# Altium schematic sheet ESP32_BDB-1.SchDoc
size Tabloid; SheetNumber: 1; SheetTotal: 2
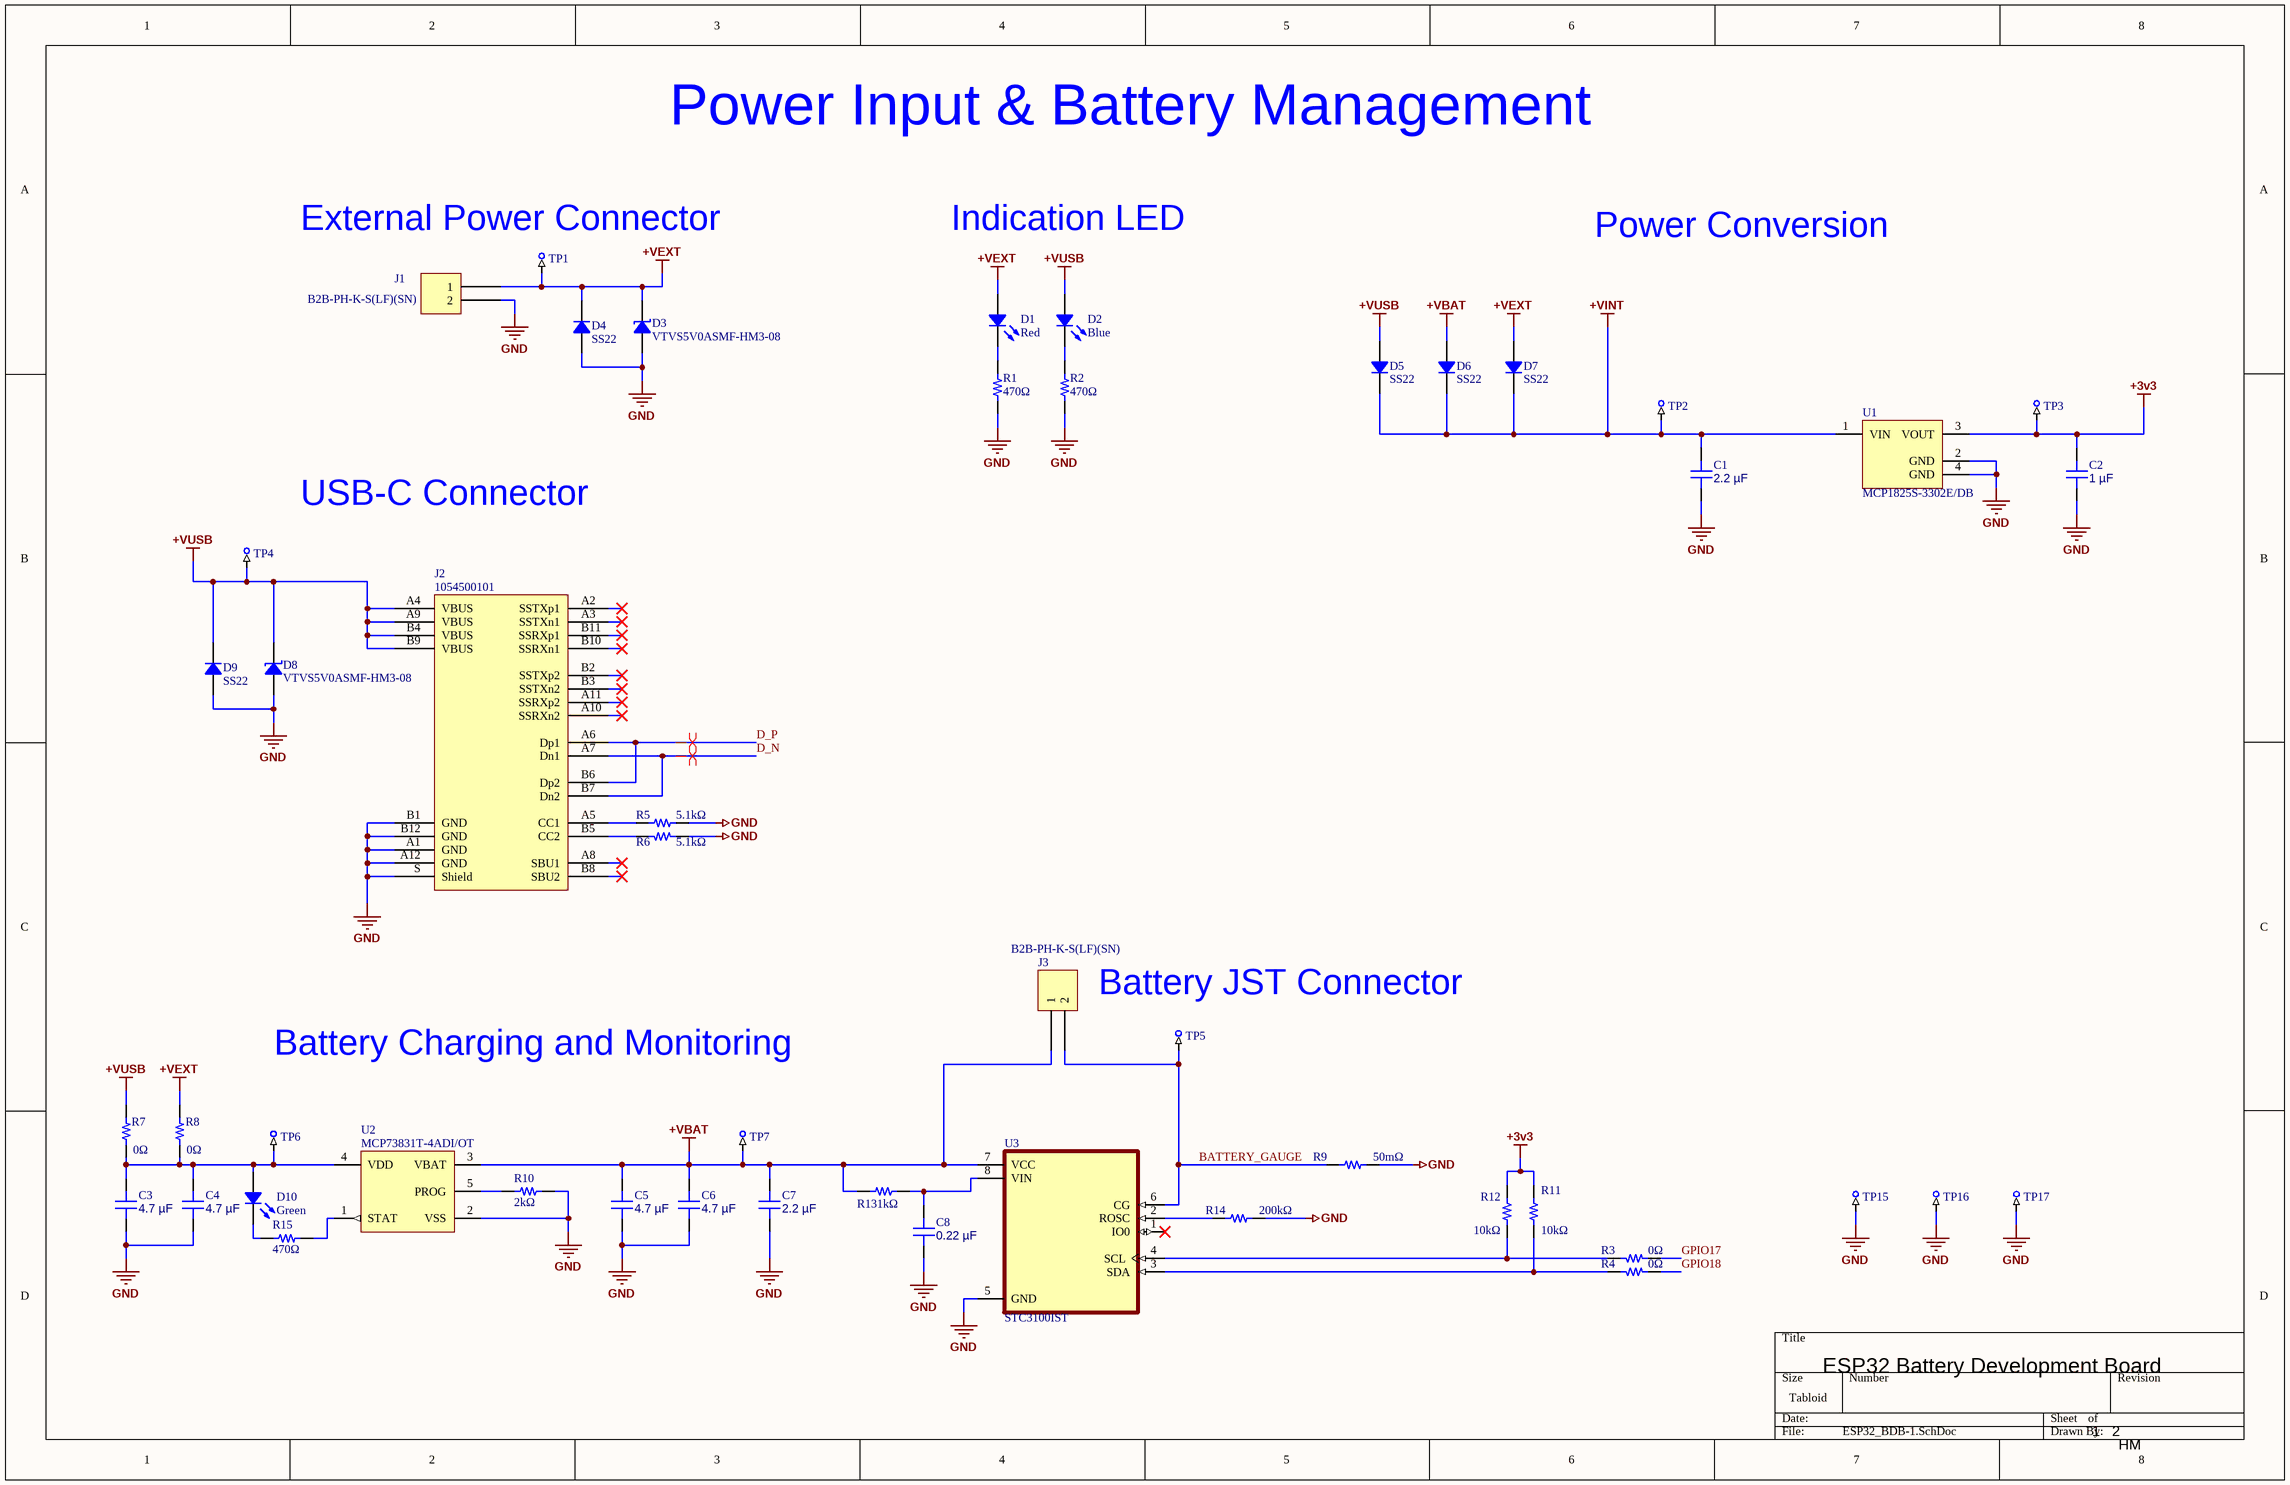
[diagram p0: ESP32_BDB-1.SchDoc]

## Parts
C1  2.2 µF  [CAP 0805_2012]
C2  1 µF  [CAP 0805_2012]
C3  4.7 µF  [CAP 0805_2012]
C4  4.7 µF  [CAP 0805_2012]
C5  4.7 µF  [CAP 0805_2012]
C6  4.7 µF  [CAP 0805_2012]
C7  2.2 µF  [CAP 0603_1608]
C8  0.22 µF  [CAP 0603_1608]
D1  Red  [LED 0805_2012 RED]
D2  Blue  [LED 0805_2012 BLUE]
D3  VTVS5V0ASMF-HM3-08  [SMF DO-219AB]
D4  SS22  [DO214AA SMB]
D5  SS22  [DO214AA SMB]
D6  SS22  [DO214AA SMB]
D7  SS22  [DO214AA SMB]
D8  VTVS5V0ASMF-HM3-08  [SMF DO-219AB]
D9  SS22  [DO214AA SMB]
D10  Green  [LED 0805_2012 GREEN]
J1  B2B-PH-K-S(LF)(SN)  [JST B2B-PH-K]
J2  1054500101  [Molex 1054500101]
J3  B2B-PH-K-S(LF)(SN)  [JST B2B-PH-K]
R1  470Ω  [RES 0603_1608]
R2  470Ω  [RES 0603_1608]
R3  0Ω  [RES 0805_2012]
R4  0Ω  [RES 0805_2012]
R5  5.1kΩ  [RES 0603_1608]
R6  5.1kΩ  [RES 0603_1608]
R7  0Ω  [RES 0805_2012]
R8  0Ω  [RES 0805_2012]
R9  50mΩ  [RES 0805_2012]
R10  2kΩ  [RES 0603_1608]
R11  10kΩ  [RES 0603_1608]
R12  10kΩ  [RES 0603_1608]
R13  1kΩ  [RES 0603_1608]
R14  200kΩ  [RES 0603_1608]
R15  470Ω  [RES 0603_1608]
TP1  5016  [KEYSTONE-5016_V]  (value not drawn)
TP2  5016  [KEYSTONE-5016_V]  (value not drawn)
TP3  5016  [KEYSTONE-5016_V]  (value not drawn)
TP4  5016  [KEYSTONE-5016_V]  (value not drawn)
TP5  5016  [KEYSTONE-5016_V]  (value not drawn)
TP6  5016  [KEYSTONE-5016_V]  (value not drawn)
TP7  5016  [KEYSTONE-5016_V]  (value not drawn)
TP15  5016  [KEYSTONE-5016_V]  (value not drawn)
TP16  5016  [KEYSTONE-5016_V]  (value not drawn)
TP17  5016  [KEYSTONE-5016_V]  (value not drawn)
U1  MCP1825S-3302E/DB  [SOT-223-DB3_N]
U2  MCP73831T-4ADI/OT  [SOT-23-OT5_N]
U3  STC3100IST  [SOIC65P490X110-8N]

## Nets
+3v3: C2.2 R11.2 R12.2 TP3.1 U1.3(VOUT)
+VBAT: C5.2 C6.2 C7.2 D6.1 J3.1 R13.1 TP7.1 U2.3(VBAT) U3.7(VCC)
+VEXT: D1.1 D3.2 D4.2 D7.1 J1.1 R8.2 TP1.1
+VINT: C1.2 D5.2 D6.2 D7.2 TP2.1 U1.1(VIN)
+VUSB: D2.1 D5.1 D8.2 D9.2 J2.A4(VBUS) J2.A9(VBUS) J2.B4(VBUS) J2.B9(VBUS) R7.2 TP4.1
GND: C1.1 C2.1 C3.1 C4.1 C5.1 C6.1 C7.1 C8.1 D3.1 D4.1 D8.1 D9.1 J1.2 J2.A1(GND) J2.A12(GND) J2.B1(GND) J2.B12(GND) J2.S(Shield) R1.2 R2.2 R5.2 R6.2 R9.2 R10.1 R14.2 TP15.1 TP16.1 TP17.1 U1.2(GND) U1.4(GND) U2.2(VSS) U3.5(GND)
BATTERY_GAUGE: J3.2 R9.1 TP5.1 U3.6(CG)
D_N: J2.A7(Dn1) J2.B7(Dn2)
D_P: J2.A6(Dp1) J2.B6(Dp2)
GPIO17: R3.1
GPIO18: R4.1
NetC3_2: C3.2 C4.2 D10.1 R7.1 R8.1 TP6.1 U2.4(VDD)
NetC8_2: C8.2 R13.2 U3.8(VIN)
NetD1_2: D1.2 R1.1
NetD2_2: D2.2 R2.1
NetD10_2: D10.2 R15.2
NetJ2_A5: J2.A5(CC1) R5.1
NetJ2_B5: J2.B5(CC2) R6.1
NetR3_2: R3.2 R12.1 U3.4(SCL)
NetR4_2: R4.2 R11.1 U3.3(SDA)
NetR10_2: R10.2 U2.5(PROG)
NetR14_1: R14.1 U3.2(ROSC)
NetR15_1: R15.1 U2.1(STAT)

Not connected (* = marked no-connect by the designer): J2 A2(SSTXp1)* A3(SSTXn1)* A8(SBU1)* A10(SSRXn2)* A11(SSRXp2)* B2(SSTXp2)* B3(SSTXn2)* B8(SBU2)* B10(SSRXn1)* B11(SSRXp1)*; U3 1(IO0)*

## Layout directives
differential pair; rule Differential Pairs Routing [Pref Gap = 5mil    Min Gap  = 5mil    Max Gap  = 5milPref Width = 10.265mil    Min Width  = 6.268mil    Max Width  = 10.265mil]: D_N, D_P

## Notes on the sheet
- Power Input & Battery Management
- (near TP1) External Power Connector
- Indication LED
- Power Conversion
- USB-C Connector
- Battery JST Connector
- Battery Charging and Monitoring
- ESP32 Battery Development Board
- 1
- 2
- HM

## Library data of the parts
C1 = 0805B225K250CT: CAP CER 2.2UF 25V X7R 0805; manufacturer: Walsin Technology Corporation; Tolerance: ±10%; Part Number: 0805B225K250CT; Capacitance: 2.2 µF; Applications: General Purpose; componentlink1description: Datasheet; componentlink1url: https://www.passivecomponent.com/wp-content/uploads/datasheet/WTC_MLCC_General_Purpose.pdf; componentlink2description: DigiKey Link; componentlink2url: https://www.digikey.com/en/products/detail/walsin-technology-corporation/0805B225K250CT/14836806; Device Package: 0805 (2012 Metric); lastupdated: 2026-04-06 7:31:50 PM; Lifecycle Status: Active; Minimum Order: 1; Mounting Type: Surface Mount, MLCC; Operating Temperature: -55°C ~ 125°C; Package / Case: 0805 (2012 Metric); packaging: TapeAndReel; partid: 40661; Part Status: Active; price: 0.01; series: -; Size / Dimension: 0.079" L x 0.049" W (2.00mm x 1.25mm); Supplier 1: DigiKey; Supplier Part Number 1: 1292-0805B225K250CT-ND; Temperature Coefficient: X7R; Thickness (Max): 0.057" (1.45mm); value: 2.2 µF; Voltage - Rated: 25V
C2 = 0805DC105KAT2A: CAP CER 1UF 35V X7R 0805; manufacturer: KYOCERA AVX; Tolerance: ±10%; Part Number: 0805DC105KAT2A; Capacitance: 1 µF; Applications: General Purpose; componentlink2description: DigiKey Link; componentlink2url: https://www.digikey.com/en/products/detail/kyocera-avx/0805DC105KAT2A/11245462; Device Package: 0805 (2012 Metric); lastupdated: 2026-04-06 7:32:10 PM; Lifecycle Status: Active; Minimum Order: 1; Mounting Type: Surface Mount, MLCC; Operating Temperature: -55°C ~ 125°C; Package / Case: 0805 (2012 Metric); packaging: TapeAndReel; partid: 33818; Part Status: Active; price: 0.03; series: -; Size / Dimension: 0.079" L x 0.049" W (2.01mm x 1.25mm); Supplier 1: DigiKey; Supplier Part Number 1: 478-0805DC105KAT2ACT-ND; Temperature Coefficient: X7R; value: 1 µF; Voltage - Rated: 35V
C3-C6 = CL21B475KAFNNNE: CAP CER 4.7UF 25V X7R 0805; manufacturer: Samsung Electro-Mechanics; Tolerance: ±10%; Part Number: CL21B475KAFNNNE; Capacitance: 4.7 µF; Applications: General Purpose; componentlink1description: Datasheet; componentlink1url: http://www.samsungsem.com/kr/support/product-search/mlcc/CL21B475KAFNNNE.jsp; componentlink2description: DigiKey Link; componentlink2url: https://www.digikey.com/en/products/detail/samsung-electro-mechanics/CL21B475KAFNNNE/3888627; Device Package: 0805 (2012 Metric); lastupdated: 2026-04-06 7:33:17 PM; Lifecycle Status: Active; Minimum Order: 1; Mounting Type: Surface Mount, MLCC; Operating Temperature: -55°C ~ 125°C; Package / Case: 0805 (2012 Metric); packaging: TapeAndReel; partid: 3072; Part Status: Active; price: 0.08; series: CL; Size / Dimension: 0.079" L x 0.049" W (2.00mm x 1.25mm); Supplier 1: DigiKey; Supplier Part Number 1: 1276-2969-1-ND; Temperature Coefficient: X7R; Thickness (Max): 0.053" (1.35mm); value: 4.7 µF; Voltage - Rated: 25V
C7 = CC0603ZRY5V7BB225: CAP CER 2.2UF 16V Y5V 0603; manufacturer: Yageo; Temperature Coefficient: Y5V (F); Tolerance: -20%, +80%; Part Number: CC0603ZRY5V7BB225; Capacitance: 2.2 µF; Applications: General Purpose; componentlink1description: Datasheet; componentlink1url: http://www.yageo.com/documents/recent/UPY-GPHC_Y5V_6.3V-to-50V_8.pdf; componentlink2description: DigiKey Link; componentlink2url: https://www.digikey.com/en/products/detail/yageo/CC0603ZRY5V7BB225/5883851; Device Package: 0603 (1608 Metric); lastupdated: 2026-04-06 7:23:53 PM; Lifecycle Status: Active; Minimum Order: 1; Mounting Type: Surface Mount, MLCC; Operating Temperature: -30°C ~ 85°C; Package / Case: 0603 (1608 Metric); packaging: TapeAndReel; partid: 2203; Part Status: Active; price: 0.01; series: CC; Size / Dimension: 0.063" L x 0.031" W (1.60mm x 0.80mm); Supplier 1: DigiKey; Supplier Part Number 1: 311-3416-1-ND; Thickness (Max): 0.035" (0.90mm); value: 2.2 µF; Voltage - Rated: 16V
C8 = C0603C224J4REC7867: CAP CER 0603 220NF 16V X7R 5%; manufacturer: KEMET; Part Number: C0603C224J4REC7867; Capacitance: 0.22 µF; Applications: ESD Protection; componentlink1description: Datasheet; componentlink1url: https://connect.kemet.com:7667/gateway/IntelliData-ComponentDocumentation/1.0/download/datasheet/C0603C224J4REC7867; componentlink2description: DigiKey Link; componentlink2url: https://www.digikey.com/en/products/detail/kemet/C0603C224J4REC7867/8643651; Device Package: 0603 (1608 Metric); lastupdated: 2026-04-06 7:19:01 PM; Lifecycle Status: Active; Minimum Order: 1; Mounting Type: Surface Mount, MLCC; Operating Temperature: -55°C ~ 125°C; Package / Case: 0603 (1608 Metric); packaging: TapeAndReel; partid: 56217; price: 0.02; series: ESD SMD Comm X7R; Size / Dimension: 0.063" L x 0.031" W (1.60mm x 0.80mm); Supplier 1: DigiKey; Supplier Part Number 1: 399-C0603C224J4REC7867CT-ND; Temperature Coefficient: X7R; Thickness (Max): 0.034" (0.87mm); Tolerance: ±5%; value: 0.22 µF; Voltage - Rated: 16V
D1 = 5990110007F: LED RED 0805 SMD; Manufacturer: Dialight; Configuration: Standard; Current - Test: 20mA; Lens Color: 0.80mm; Lens Size: 1.40mm x 1.25mm; Lens Style: Rectangle with Flat Top; Millicandela Rating: 29mcd; Viewing Angle: 140°; Voltage - Forward (Vf) (Typ): 2.1V; Wavelength - Dominant: 633nm; Part Number: 5990110007F; Color: Red; ComponentLink1Description: Datasheet; ComponentLink1URL: http://www.dialightsignalsandcomponents.com/Assets/Brochures_And_Catalogs/Indication/CBI_SMD_new/Dialight_CBI_data_599-0805_Apr2018.pdf; ComponentLink2Description: DigiKey Link; ComponentLink2URL: https://www.digikey.com/en/products/detail/dialight/5990110007F/9385408; Device Package: 0805 (2012 Metric); Height (Max): 0.80mm; LastUpdated: 2026-04-05 8:38:27 PM; Lifecycle Status: Active; Minimum Order: 1; Mounting Type: Surface Mount; Package / Case: 0805 (2012 Metric); Packaging: TapeAndReel; PartId: 308; Part Status: Active; Price: 0.04; Series: 599; Size / Dimension: 2.00mm L x 1.25mm W; Supplier 1: DigiKey; Supplier Part Number 1: 350-4353-1-ND; Supplier Device Package: 0805; Value: Red
D2 = IN-S85AT5B: LED BLUE CLEAR 0805 SMD; Manufacturer: Inolux; Configuration: Standard; Current - Test: 5mA; Lens Color: Colorless; Lens Size: 1.40mm x 1.25mm; Lens Style: Rectangle with Flat Top; Millicandela Rating: 80mcd; Viewing Angle: 120°; Voltage - Forward (Vf) (Typ): 3V; Wavelength - Dominant: 470nm; Wavelength - Peak: 473nm; Part Number: IN-S85AT5B; Color: Blue; ComponentLink1Description: Datasheet; ComponentLink1URL: http://www.inolux-corp.com/datasheet/SMDLED/Mono%20Color%20Top%20View/IN-S85AT%20Series_V1.1.pdf; ComponentLink2Description: DigiKey Link; ComponentLink2URL: https://www.digikey.com/en/products/detail/inolux/IN-S85AT5B/7604912; Device Package: 0805 (2012 Metric); Height (Max): 1.10mm; LastUpdated: 2026-04-05 8:35:18 PM; Lens Transparency: Clear; Lifecycle Status: Active; Minimum Order: 1; Mounting Type: Surface Mount; Package / Case: 0805 (2012 Metric); Packaging: TapeAndReel; PartId: 751; Part Status: Active; Price: 0.04; Series: IN-S85AT; Size / Dimension: 2.00mm L x 1.25mm W; Supplier 1: DigiKey; Supplier Part Number 1: 1830-IN-S85AT5BCT-ND; Supplier Device Package: 0805; Value: Blue
D3 D8 = VTVS5V0ASMF-HM3-08: TVS DIODE 5V 8.9V DO219AB; Manufacturer: Vishay Semiconductor Diodes Division; Capacitance @ Frequency: 2095pF @ 1MHz; Current - Peak Pulse (10/1000µs): 42.95A; Power Line Protection: No; Power - Peak Pulse: 400W; Type: Zener; Unidirectional Channels: 1; Voltage - Breakdown (Min): 6.4V; Part Number: VTVS5V0ASMF-HM3-08; Applications: Automotive; ComponentLink1Description: Datasheet; ComponentLink1URL: http://www.vishay.com/docs/85891/vtvs3v3asmf.pdf; ComponentLink2Description: DigiKey Link; ComponentLink2URL: http://digikey.com/product-detail/en/vishay-semiconductor-diodes-division/VTVS5V0ASMF-HM3-08/VTVS5V0ASMF-HM3-08GICT-ND/7056002; LastUpdated: 2026-04-05 9:00:09 PM; Lifecycle Status: Active; Minimum Order: 1; Mounting Type: Surface Mount; Operating Temperature: -55°C ~ 175°C (TJ); Package / Case: DO-219AB; Packaging: TapeAndReel; PartId: 5532; Part Status: Active; Price: 0.12; Series: Automotive, AEC-Q101, TransZorb®; Supplier 1: DigiKey; Supplier Part Number 1: VTVS5V0ASMF-HM3-08GICT-ND; Supplier Device Package: DO-219AB (SMF); Voltage - Clamping (Max) @ Ipp: 8.9V; Voltage - Reverse Standoff (Typ): 5V
D4-D7 D9 = SS22: DIODE SCHOTTKY 20V 2A DO214AA; Manufacturer: ON Semiconductor; Current - Reverse Leakage @ Vr: 400µA @ 20V; Speed: Fast Recovery =< 500ns, > 200mA (Io); Voltage - Forward (Vf) (Max) @ If: 500mV @ 2A; Part Number: SS22; ComponentLink1Description: Datasheet; ComponentLink1URL: https://www.onsemi.com/pub/Collateral/SS29-D.pdf; ComponentLink2Description: DigiKey Link; ComponentLink2URL: http://digikey.com/product-detail/en/on-semiconductor/SS22/SS22FSCT-ND/3504400; Current - Average Rectified (Io): 2A; Diode Type: Schottky; LastUpdated: 2026-04-05 8:31:00 PM; Lifecycle Status: Active; Minimum Order: 1; Mounting Type: Surface Mount; Operating Temperature - Junction: -65°C ~ 125°C; Package / Case: DO-214AA, SMB; Packaging: TapeAndReel; PartId: 1568; Part Status: Active; Price: 0.15; Series: -; Supplier 1: DigiKey; Supplier Part Number 1: SS22FSCT-ND; Supplier Device Package: DO-214AA (SMB); Voltage - DC Reverse (Vr) (Max): 20V
D10 = 5975316507F: LED GREEN 0805 SMD; Manufacturer: Dialight; Configuration: Standard; Current - Test: 20mA; Lens Color: 0.93mm; Lens Size: 1.40mm x 1.24mm; Lens Style: Rectangle with Flat Top; Millicandela Rating: 16mcd; Voltage - Forward (Vf) (Typ): 2.2V; Wavelength - Dominant: 560nm; Part Number: 5975316507F; Color: Green; ComponentLink1Description: Datasheet; ComponentLink1URL: http://www.dialightsignalsandcomponents.com/Assets/Drawings/2D_Drawings_DrawingDetailedSpec/NewDrawings/18370A.pdf; ComponentLink2Description: DigiKey Link; ComponentLink2URL: https://www.digikey.com/en/products/detail/dialight/5975316507F/9385444; Device Package: 0805 (2012 Metric); Height (Max): 0.93mm; LastUpdated: 2026-04-05 8:39:04 PM; Lifecycle Status: Active; Minimum Order: 1; Mounting Type: Surface Mount; Package / Case: 0805 (2012 Metric); Packaging: TapeAndReel; PartId: 245; Part Status: Active; Price: 0.14; Series: 597; Size / Dimension: 2.00mm L x 1.25mm W; Supplier 1: DigiKey; Supplier Part Number 1: 350-4389-1-ND; Supplier Device Package: 0805; Value: Green
J1 J3 = B2B-PH-K-S(LF)(SN): CONN HEADER VERT 2POS 2MM; Manufacturer: JST Sales America Inc.; Contact Length - Mating: 0.130" (3.30mm); Contact Length - Post: 0.134" (3.40mm); Current Rating (Amps): 2A; Material Flammability Rating: UL94 V-0; Number of Positions: 2; Number of Positions Loaded: All; Overall Contact Length: 0.333" (8.45mm); Pitch - Mating: 0.079" (2.00mm); Shrouding: Shrouded - 4 Wall; Style: Board to Cable/Wire; Voltage Rating: 100V; Part Number: B2B-PH-K-S(LF)(SN); ComponentLink1Description: Datasheet; ComponentLink1URL: http://www.jst-mfg.com/product/pdf/eng/ePH.pdf; ComponentLink2Description: DigiKey Link; ComponentLink2URL: http://digikey.com/product-detail/en/jst-sales-america-inc/B2B-PH-K-S-LF-SN/455-1704-ND/926611; Connector Type: Header; Contact Finish - Mating: Tin; Contact Finish - Post: Tin; Contact Material: Brass; Contact Shape: Square; Contact Type: Male Pin; Fastening Type: Detent Lock; Insulation Color: Natural; Insulation Height: 0.236" (6.00mm); Insulation Material: Polyamide (PA66), Nylon 6/6; LastUpdated: 2020-01-03 11:40:58 PM; Lifecycle Status: Active; Minimum Order: 1; Mounting Type: Through Hole; Number of Rows: 1; Operating Temperature: -25°C ~ 85°C; Packaging: Bulk; PartId: 11; Part Status: Active; Price: 0.17; Series: PH; Supplier 1: DigiKey; Supplier Part Number 1: 455-1704-ND; Termination: Press-Fit, Solder
J2 = 1054500101: CONN RCP USB3.1 TYPEC 24P SMD RA; Manufacturer: Molex; Connector Type: USB - C (Type - C); Current Rating (Amps): 0.25A, 1A, 5A; Gender: Receptacle; Mating Cycles: 10000; Number of Contacts: 24; Number of Ports: 1; Shielding: Shielded; Specifications: USB 3.1 (USB 3.1 Gen 2, Superspeed+); Voltage - Rated: 30VAC/DC; Part Number: 1054500101; ComponentLink1Description: Datasheet; ComponentLink1URL: https://www.molex.com/pdm_docs/ps/PS-105448-001.pdf; ComponentLink2Description: DigiKey Link; ComponentLink2URL: http://digikey.com/product-detail/en/molex/1054500101/WM12856CT-ND/5843891; LastUpdated: 2020-06-06 2:14:04 AM; Lifecycle Status: Active; Minimum Order: 1; Mounting Feature: Horizontal; Mounting Type: Surface Mount, Right Angle; Through Hole; Operating Temperature: -30°C ~ 85°C; Packaging: TapeAndReel; Part Status: Active; Price: 1.22; Series: 105445; Supplier 1: DigiKey; Supplier Part Number 1: WM12856CT-ND; Termination: Solder
R1 R2 R15 = AC0603FR-7W470RL: RES 470 OHM 1% 1/5W 0603; Manufacturer: Yageo; Value: 470 Ohms; Power (Watts): 0.2W, 1/5W; Temperature Coefficient: ±100ppm/°C; Part Number: AC0603FR-7W470RL; ComponentLink1Description: Datasheet; ComponentLink1URL: https://www.yageo.com/upload/media/product/productsearch/datasheet/rchip/PYu-AC_51_RoHS_L_10.pdf; ComponentLink2Description: DigiKey Link; ComponentLink2URL: https://www.digikey.com/en/products/detail/yageo/AC0603FR-7W470RL/16993211; Composition: Thick Film; Device Package: 0603 (1608 Metric); Features: Automotive AEC-Q200, Moisture Resistant; Height - Seated (Max): 0.022" (0.55mm); LastUpdated: 2026-04-06 7:43:15 PM; Lifecycle Status: Active; Minimum Order: 1; Number of Terminations: 2; Operating Temperature: -55°C ~ 155°C; Package / Case: 0603 (1608 Metric); Packaging: TapeAndReel; PartId: 87159; Price: 0.01; Ratings: AEC-Q200; Resistance: 470 Ohms; Series: AC; Size / Dimension: 0.063" L x 0.031" W (1.60mm x 0.80mm); Supplier 1: DigiKey; Supplier Part Number 1: 13-AC0603FR-7W470RLCT-ND; Supplier Device Package: 0603; Tolerance: ±1%
R3 R4 R7 R8 = TLRZ2ATTD: RES 0 OHM JUMPER 0805; Manufacturer: KOA Speer Electronics, Inc.; Value: 0 Ohms; Part Number: TLRZ2ATTD; ComponentLink1Description: Datasheet; ComponentLink1URL: http://www.koaspeer.com/catimages/Products/TLRZ/TLRZ.pdf; ComponentLink2Description: DigiKey Link; ComponentLink2URL: https://www.digikey.com/en/products/detail/koa-speer-electronics-inc/TLRZ2ATTD/9845494; Composition: Metal Element; Device Package: 0805 (2012 Metric); Features: Automotive AEC-Q200, Current Sense; Height - Seated (Max): 0.022" (0.55mm); LastUpdated: 2026-04-05 8:11:26 PM; Lifecycle Status: Active; Minimum Order: 1; Number of Terminations: 2; Operating Temperature: -65°C ~ 170°C; Package / Case: 0805 (2012 Metric); Packaging: TapeAndReel; PartId: 27685; Part Status: Active; Price: 0.08; Ratings: AEC-Q200; Resistance: 0 Ohms; Series: TLRZ; Size / Dimension: 0.079" L x 0.049" W (2.00mm x 1.25mm); Supplier 1: DigiKey; Supplier Part Number 1: 2019-TLRZ2ATTDCT-ND; Supplier Device Package: 0805; Tolerance: Jumper
R5 R6 = AC0603FR-075K1L: RES SMD 5.1K OHM 1% 1/10W 0603; Manufacturer: Yageo; Value: 5.1 kOhms; Power (Watts): 0.1W, 1/10W; Temperature Coefficient: ±100ppm/°C; Part Number: AC0603FR-075K1L; ComponentLink1Description: Datasheet; ComponentLink1URL: https://www.yageo.com/upload/media/product/productsearch/datasheet/rchip/PYu-AC_51_RoHS_L_7.pdf; ComponentLink2Description: DigiKey Link; ComponentLink2URL: https://www.digikey.com/en/products/detail/yageo/AC0603FR-075K1L/5896209; Composition: Thick Film; Device Package: 0603 (1608 Metric); Features: Automotive AEC-Q200, Moisture Resistant; Height - Seated (Max): 0.022" (0.55mm); LastUpdated: 2026-04-06 7:43:48 PM; Lifecycle Status: Active; Minimum Order: 1; Number of Terminations: 2; Operating Temperature: -55°C ~ 155°C; Package / Case: 0603 (1608 Metric); Packaging: CutTape; PartId: 17442; Part Status: Active; Price: 0.01; Ratings: AEC-Q200; Resistance: 5.1 kOhms; Series: AC; Size / Dimension: 0.063" L x 0.031" W (1.60mm x 0.80mm); Supplier 1: DigiKey; Supplier Part Number 1: YAG3621CT-ND; Supplier Device Package: 0603; Tolerance: ±1%
R9 = RL-1220-4-R050-FNH: RES 0.05 OHM 1% 1/2W 0805; Manufacturer: Delta Electronics/Cyntec; Value: 50 mOhms; Power (Watts): 0.5W, 1/2W; Temperature Coefficient: ±100ppm/°C; Part Number: RL-1220-4-R050-FNH; ComponentLink1Description: Datasheet; ComponentLink1URL: http://www.cyntec.com/upfile/products/download/RL-1220-4.pdf; ComponentLink2Description: DigiKey Link; ComponentLink2URL: http://digikey.com/product-detail/en/delta-electronics-cyntec/RL-1220-4-R050-FNH/2037-RL-1220-4-R050-FNHCT-ND/10446138; Composition: Metal Foil; Device Package: 0805 (2012 Metric); Features: Current Sense; Height - Seated (Max): 0.041" (1.05mm); LastUpdated: 2026-04-05 8:11:17 PM; Lifecycle Status: Active; Minimum Order: 1; Number of Terminations: 2; Operating Temperature: -55°C ~ 170°C; Package / Case: 0805 (2012 Metric); Packaging: TapeAndReel; PartId: 29837; Part Status: Active; Price: 0.17; Resistance: 50 mOhms; Series: RL-1220; Size / Dimension: 0.079" L x 0.051" W (2.00mm x 1.30mm); Supplier 1: DigiKey; Supplier Part Number 1: 2037-RL-1220-4-R050-FNHCT-ND; Supplier Device Package: 0805; Tolerance: ±1%
R10 = AC0603FR-7W2KL: RES 2K OHM 1% 1/5W 0603; Manufacturer: Yageo; Value: 2 kOhms; Power (Watts): 0.2W, 1/5W; Temperature Coefficient: ±100ppm/°C; Part Number: AC0603FR-7W2KL; ComponentLink1Description: Datasheet; ComponentLink1URL: https://www.yageo.com/upload/media/product/productsearch/datasheet/rchip/PYu-AC_51_RoHS_L_10.pdf; ComponentLink2Description: DigiKey Link; ComponentLink2URL: https://www.digikey.com/en/products/detail/yageo/AC0603FR-7W2KL/16990990; Composition: Thick Film; Device Package: 0603 (1608 Metric); Features: Automotive AEC-Q200, Moisture Resistant; Height - Seated (Max): 0.022" (0.55mm); LastUpdated: 2026-04-06 7:42:46 PM; Lifecycle Status: Active; Minimum Order: 1; Number of Terminations: 2; Operating Temperature: -55°C ~ 155°C; Package / Case: 0603 (1608 Metric); Packaging: TapeAndReel; PartId: 91069; Price: 0.01; Ratings: AEC-Q200; Resistance: 2 kOhms; Series: AC; Size / Dimension: 0.063" L x 0.031" W (1.60mm x 0.80mm); Supplier 1: DigiKey; Supplier Part Number 1: 13-AC0603FR-7W2KLCT-ND; Supplier Device Package: 0603; Tolerance: ±1%
R11 R12 = AA0603FR-0710KL: RES SMD 10K OHM 1% 1/10W 0603; Manufacturer: Yageo; Value: 10 kOhms; Power (Watts): 0.1W, 1/10W; Temperature Coefficient: ±150ppm/°C; Part Number: AA0603FR-0710KL; ComponentLink1Description: Datasheet; ComponentLink1URL: https://www.yageo.com/upload/media/product/productsearch/datasheet/rchip/PYu-AA_51_RoHS_L_3.pdf; ComponentLink2Description: DigiKey Link; ComponentLink2URL: https://www.digikey.com/en/products/detail/yageo/AA0603FR-0710KL/5888698; Composition: Thick Film; Device Package: 0603 (1608 Metric); Features: Anti-Sulfur, Automotive AEC-Q200, Moisture Resistant; Height - Seated (Max): 0.022" (0.55mm); LastUpdated: 2026-04-06 7:43:37 PM; Lifecycle Status: Active; Minimum Order: 1; Number of Terminations: 2; Operating Temperature: -55°C ~ 155°C; Package / Case: 0603 (1608 Metric); Packaging: TapeAndReel; PartId: 64302; Part Status: Active; Price: 0.01; Ratings: AEC-Q200; Resistance: 10 kOhms; Series: AA; Size / Dimension: 0.063" L x 0.031" W (1.60mm x 0.80mm); Supplier 1: DigiKey; Supplier Part Number 1: 13-AA0603FR-0710KLCT-ND; Supplier Device Package: 0603; Tolerance: ±1%
R13 = AA0603FR-071KL: RES SMD 1K OHM 1% 1/10W 0603; Manufacturer: Yageo; Value: 1 kOhms; Power (Watts): 0.1W, 1/10W; Temperature Coefficient: ±150ppm/°C; Part Number: AA0603FR-071KL; ComponentLink1Description: Datasheet; ComponentLink1URL: https://www.yageo.com/upload/media/product/productsearch/datasheet/rchip/PYu-AA_51_RoHS_L_3.pdf; ComponentLink2Description: DigiKey Link; ComponentLink2URL: https://www.digikey.com/en/products/detail/yageo/AA0603FR-071KL/5888847; Composition: Thick Film; Device Package: 0603 (1608 Metric); Features: Anti-Sulfur, Automotive AEC-Q200, Moisture Resistant; Height - Seated (Max): 0.022" (0.55mm); LastUpdated: 2026-04-06 7:43:37 PM; Lifecycle Status: Active; Minimum Order: 1; Number of Terminations: 2; Operating Temperature: -55°C ~ 155°C; Package / Case: 0603 (1608 Metric); Packaging: TapeAndReel; PartId: 64335; Part Status: Active; Price: 0.01; Ratings: AEC-Q200; Resistance: 1 kOhms; Series: AA; Size / Dimension: 0.063" L x 0.031" W (1.60mm x 0.80mm); Supplier 1: DigiKey; Supplier Part Number 1: 13-AA0603FR-071KLCT-ND; Supplier Device Package: 0603; Tolerance: ±1%
R14 = AT0603BRD07200KL: RES SMD 200K OHM 0.1% 1/10W 0603; Manufacturer: Yageo; Value: 200 kOhms; Power (Watts): 0.1W, 1/10W; Temperature Coefficient: ±25ppm/°C; Part Number: AT0603BRD07200KL; ComponentLink1Description: Datasheet; ComponentLink1URL: https://www.yageo.com/upload/media/product/app/datasheet/rchip/pyu-at_51_rohs_l.pdf; ComponentLink2Description: DigiKey Link; ComponentLink2URL: https://www.digikey.com/en/products/detail/yageo/AT0603BRD07200KL/5907576; Composition: Thin Film; Device Package: 0603 (1608 Metric); Features: Anti-Sulfur, Automotive AEC-Q200, Moisture Resistant; Height - Seated (Max): 0.022" (0.55mm); LastUpdated: 2026-04-06 7:43:01 PM; Lifecycle Status: Active; Minimum Order: 1; Number of Terminations: 2; Operating Temperature: -55°C ~ 155°C; Package / Case: 0603 (1608 Metric); Packaging: TapeAndReel; PartId: 91209; Price: 0.07; Ratings: AEC-Q200; Resistance: 200 kOhms; Series: AT; Size / Dimension: 0.063" L x 0.031" W (1.60mm x 0.80mm); Supplier 1: DigiKey; Supplier Part Number 1: 13-AT0603BRD07200KLCT-ND; Supplier Device Package: 0603; Tolerance: ±0.1%
TP1-TP7 TP15-TP17 = CMP-2000-05178-1: Test Point, 1-Pin SMT, RoHS, Tape and Reel; Manufacturer: Keystone; Other Names: 5016KDKR; Featured Product: SurfaceMountTestPoints / 5019MiniatureSurfaceMountTestPoint; Online Catalog: SurfaceMountTestPoints; Catalog Drawings: 5016Top / 5016Side / 5016Front; Packaging: Digi-Reel; RoHS Information: RoHSComplianceStatement; Package Reference: 5016; Mounting Type: SurfaceMount; Type: PCTestPoint,Compact; Manufacturer URL: http://www.keyelco.com/; Standard Package: 1; Package Description: 1-Pin Test Point, Body 3.81 x 2.04 mm; Category: TestandMeasurement; Terminal: 0.015"(0.38mm)PhosphorBronze,SilverPlated; Datasheet URL: https://ciiva.com/datasheet-click-2917613?src=ciiva&sig=4a4e90f; Datasheet Version: Rev. D, 03/2014; Family: TestPoints; Material: PhosphorBronze
U1 = CMP-0136-00458-1: 500 mA, Low Voltage, Low Quiescent Current LDO Regulator, 3-Pin SOT-223, Extended Temperature; PackageReference: SOT-223-DB3; PackageDescription: 3-Lead Plastic Small Outline Transistor (DB) [SOT-223]; PackageVersion: revBB, Aug-2009; DatasheetVersion: revB, Feb-2008
U2 = CMP-0133-00137-1: Miniature Single-Cell, Fully Integrated Li-Ion, Li-Polymer Charge Management Controller, 4.4V, 5-Pin SOT-23, Industrial Temperature, Tape and Reel; PackageDescription: 5-Lead Plastic Small Outline Transistor (OT) [SOT-23]; DatasheetVersion: revE, Sep-2008; PackageReference: SOT-23-OT5; PackageVersion: revBB, Aug-2009; Code_IPC: SOT23-5
U3 = STC3100IST: Battery Battery Monitor IC Lithium Ion 8-MiniSO; MF: STMicroelectronics; SnapEDA_Link: https://www.snapeda.com/parts/STC3100IST/STMicroelectronics/view-part/?ref=snap; Package: TSSOP-8 STMicroelectronics; Value: *; MP: STC3100IST; Check_prices: https://www.snapeda.com/parts/STC3100IST/STMicroelectronics/view-part/?ref=eda